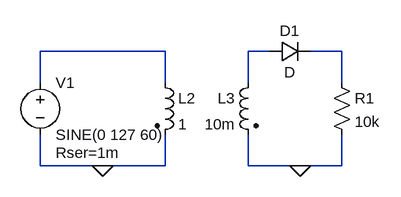
[diagram p0: schematic ex5.asc]
ex5.asc, the LTspice schematic file:
Version 4
SHEET 1 880 680
WIRE -48 64 -240 64
WIRE 112 64 80 64
WIRE 224 64 176 64
WIRE -240 112 -240 64
WIRE -48 112 -48 64
WIRE 80 112 80 64
WIRE 224 112 224 64
WIRE -240 240 -240 192
WIRE -144 240 -240 240
WIRE -48 240 -48 192
WIRE -48 240 -144 240
WIRE 80 240 80 192
WIRE 160 240 80 240
WIRE 224 240 224 192
WIRE 224 240 160 240
FLAG -144 240 0
FLAG 160 240 0
SYMBOL voltage -240 96 R0
WINDOW 123 0 0 Left 2
WINDOW 39 24 124 Left 2
SYMATTR SpiceLine Rser=1m
SYMATTR InstName V1
SYMATTR Value SINE(0 127 60)
SYMBOL ind2 -64 96 R0
SYMATTR InstName L2
SYMATTR Value 1
SYMATTR Type ind
SYMBOL ind2 96 96 M0
SYMATTR InstName L3
SYMATTR Value 10m
SYMATTR Type ind
SYMBOL res 208 96 R0
SYMATTR InstName R1
SYMATTR Value 10k
SYMBOL diode 112 80 R270
WINDOW 0 32 32 VTop 2
WINDOW 3 0 32 VBottom 2
SYMATTR InstName D1

The netlist it stands for:
* ex5.asc
V1 N001 0 SINE(0 127 60) Rser=1m
L2 N001 0 1
L3 N002 0 10m
R1 N003 0 10k
D1 N002 N003 D
.model D D
.lib standard.dio
.backanno
.end